# Altium project BB_OPAMP.PrjPcb
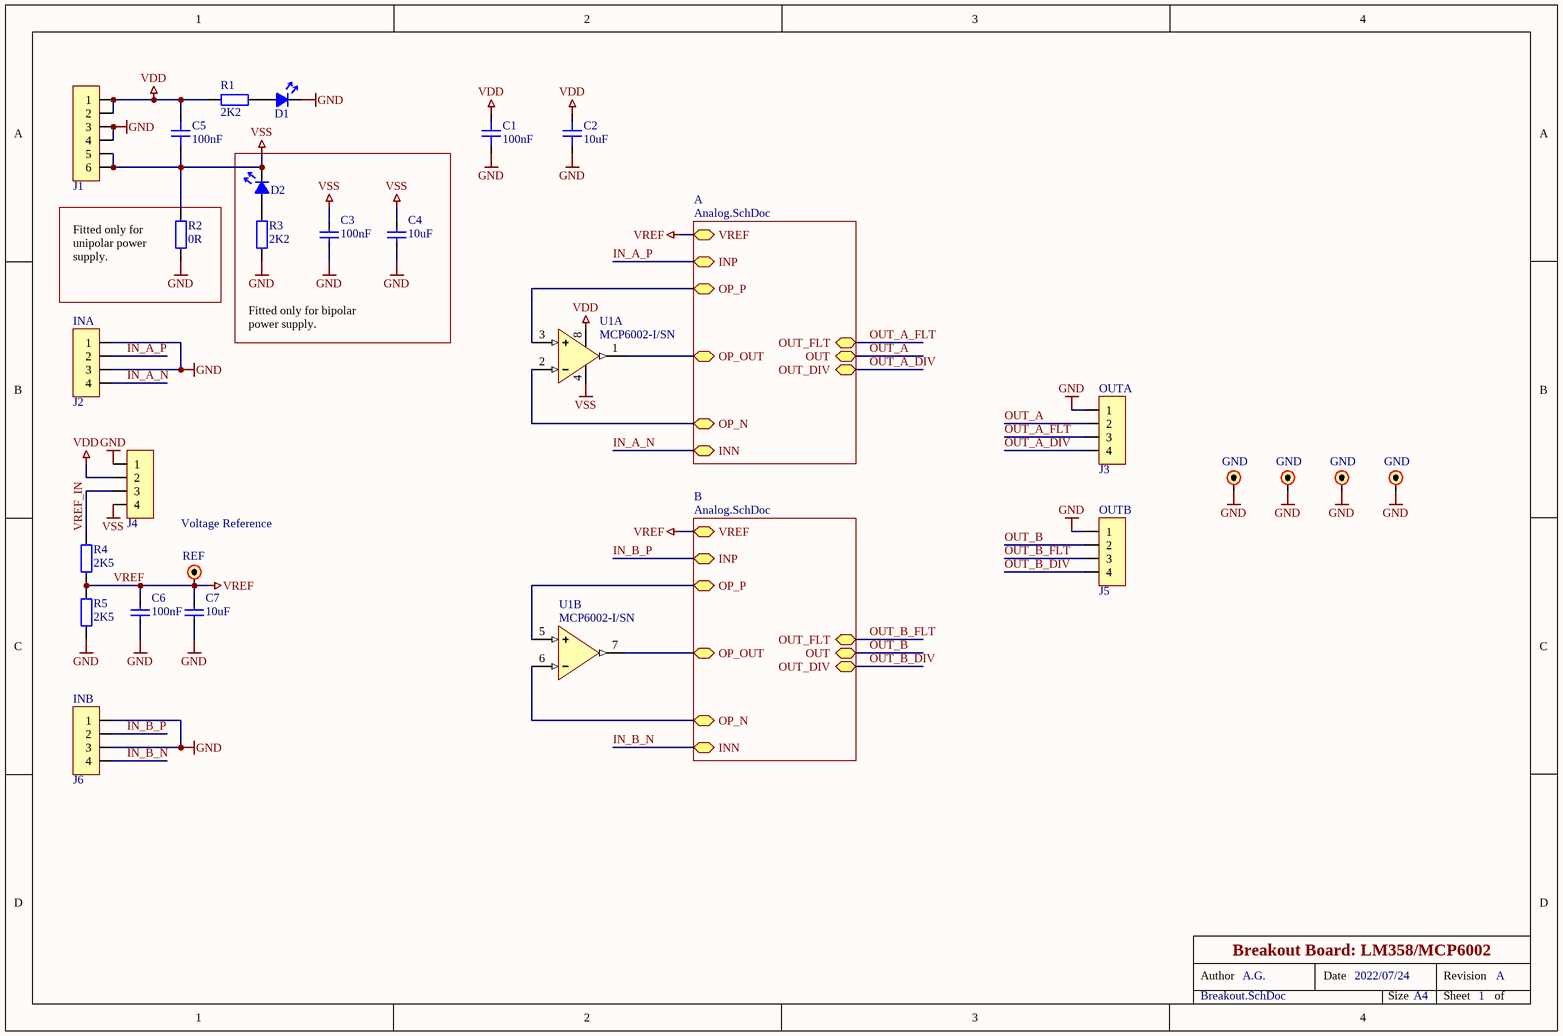
[diagram p0: Breakout.SchDoc]
Title: Breakout Board: LM358/MCP6002; Revision: A; DrawnBy: A.G.; Date: 2022/07/24
2 sheets, 70 parts. Net scope: hierarchical (ports join the sheet entries above them; power ports are global).
Board file: BB_OPAMP.PcbDoc
Sheets:
  Breakout.SchDoc
    A = Analog.SchDoc
    B = Analog.SchDoc

## Sheet Breakout.SchDoc: Breakout Board: LM358/MCP6002
size A4; Date: 2022/07/24; DrawnBy: A.G.; DocumentNumber: 1; Revision: A; SheetNumber: 1; ProjectName: BB_OPAMP.PrjPcb

### Parts
C1  100nF  [0805C_RF_M]
C2  10uF  [0805C_RF_M]
C3  100nF  [0805C_RF_M]
C4  10uF  [0805C_RF_M]
C5  100nF  [0805C_RF_M]
C6  100nF  [0805C_RF_M]
C7  10uF  [0805C_RF_M]
D1  Unspecified  [0805LED_RF_M]  (value not drawn)
D2  Unspecified  [0805LED_RF_M]  (value not drawn)
J1  PINHDR-6P1  [HEADER-2.54-6P1]  (value not drawn)
J2  INA  [HEADER-2.54-4P1]
J3  OUTA  [HEADER-2.54-4P1]
J4  PINHDR-4P1  [HEADER-2.54-4P1]  (value not drawn)
J5  OUTB  [HEADER-2.54-4P1]
J6  INB  [HEADER-2.54-4P1]
R1  2K2  [0805R_RF_M]
R2  0R  [0805R_RF_M]
R3  2K2  [0805R_RF_M]
R4  2K5  [0805R_RF_M]
R5  2K5  [0805R_RF_M]
TP1  GND  [PAD_R_1.5MM]
TP2  GND  [PAD_R_1.5MM]
TP3  GND  [PAD_R_1.5MM]
TP4  GND  [PAD_R_1.5MM]
TP10  REF  [PAD_R_1.5MM]
U1  MCP6002-I/SN  [SOIC-8]  (parts A,B of 2)

### Sub-sheets
A = Analog.SchDoc: OP_OUT, VREF, OUT_FLT, OP_P, OUT, OUT_DIV, INN, INP, OP_N
B = Analog.SchDoc: OP_OUT, VREF, OUT_FLT, OP_P, OUT, OUT_DIV, INN, INP, OP_N

### Nets
GND: C1.1 C2.1 C3.1 C4.1 C6.1 C7.1 D1.C J1.3 J1.4 J2.1 J2.3 J3.1 J4.1 J5.1 J6.1 J6.3 R2.1 R3.2 R5.1 TP1.1 TP2.1 TP3.1 TP4.1
VDD: C1.2 C2.2 C5.2 J1.1 J1.2 J4.2 R1.1 U1.8
VREF: C6.2 C7.2 R4.1 R5.2 TP10.1 ; sheet A/VREF, sheet B/VREF
VSS: C3.2 C4.2 C5.1 D2.C J1.5 J1.6 J4.4 R2.2 U1.4
FBKN: U1.6 ; sheet B/OP_N
FBKN: U1.2 ; sheet A/OP_N  [a separate net that carries the same name]
FBKP: U1.5 ; sheet B/OP_P
FBKP: U1.3 ; sheet A/OP_P  [a separate net that carries the same name]
IN_A_N: J2.4 ; sheet A/INN
IN_A_P: J2.2 ; sheet A/INP
IN_B_N: J6.4 ; sheet B/INN
IN_B_P: J6.2 ; sheet B/INP
OUT_A: J3.2 U1.1 ; sheet A/OP_OUT, sheet A/OUT  [project net OUT]
OUT_A_DIV: J3.4 ; sheet A/OUT_DIV
OUT_A_FLT: J3.3 ; sheet A/OUT_FLT
OUT_B: J5.2 U1.7 ; sheet B/OP_OUT, sheet B/OUT  [project net OUT]
OUT_B_DIV: J5.4 ; sheet B/OUT_DIV
OUT_B_FLT: J5.3 ; sheet B/OUT_FLT
VREF_IN: J4.3 R4.2
NetD1_A: D1.A R1.2
NetD2_A: D2.A R3.1

### Notes on the sheet
- (near R2) Fitted only for unipolar power supply.
- Fitted only for bipolar power supply.
- Voltage Reference
- Author
- Date
- Revision
- Size
- A4
- Sheet
- of

### Library data of the parts
C1-C7 = C: Capacitor; Manufacturer: Generic Brand; Max Voltage: ? V; Tolerance: ?; Mounting Technology: SMT; Tag: *; Manufacturer Part No: *; Supplier: *; Supplier Link: http://; Supplier Part No: *; Category: Capacitor
  C1 C3 C5 C6: Value: 100nF
  C2 C4 C7: Value: 10uF
D1 D2 = LED: Manufacturer: Generic Brand; Forward Voltage Drop: ? V; Emitting Color: Unspecified; Manufacturer Part No: *; Supplier: *; Supplier Link: http://; Supplier Part No: *; Category: Diode; Mounting Technology: SMT
J1 = PINHDR-6P1: Pin Header Single Row 6 Positions; Mounting Technology: THT
J2-J6 = PINHDR-4P1: Generic Pin Header 4x1
R1-R5 = R: Resistor; Manufacturer: Generic Brand; Power Rating: ? W; Max Voltage: ? V; Tolerance: ?; Supplier Link: http://; Category: Resistor; Mounting Technology: SMT
  R1 R3: Value: 2K2
  R2: Value: 0R
  R4 R5: Value: 2K5
TP1-TP4 TP10 = Test Point: Test Point / Pad
U1 = MCP6002-I/SN: IC OPAMP GP 2 CIRCUIT 8SOIC; DIGIKEY_PART_NO: MCP6002-I/SN-ND; DIGIKEY_URL: https://www.digikey.com/en/products/detail/microchip-technology/MCP6002-I-SN/500876; DIGIKEY_UNIT_PRICE: $0.33

## Sheet Analog.SchDoc: Breakout Board: LM358/MCP6002
size A4; Date: 2022/07/24; DrawnBy: A.G.; DocumentNumber: 1; Revision: A; SheetNumber: 1; ProjectName: BB_OPAMP.PrjPcb
Used 2 times, as channels A, B. Parts and nets are listed once, with the designators drawn on the sheet.
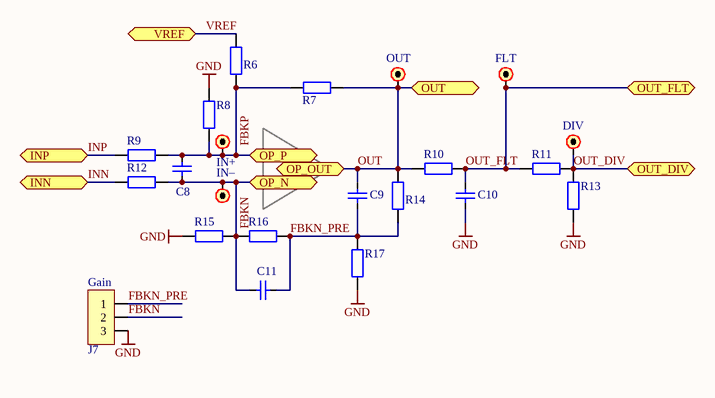
[diagram p1: Analog.SchDoc]

### Parts
C8  ? F  [0805C_RF_M]  (value not drawn)
C9  ? F  [0805C_RF_M]  (value not drawn)
C10  ? F  [0805C_RF_M]  (value not drawn)
C11  ? F  [0805C_RF_M]  (value not drawn)
J7  Gain  [HEADER-2.54-3P1]
R6  ? R  [0805R_RF_M]  (value not drawn)
R7  ? R  [0805R_RF_M]  (value not drawn)
R8  ? R  [0805R_RF_M]  (value not drawn)
R9  ? R  [0805R_RF_M]  (value not drawn)
R10  ? R  [0805R_RF_M]  (value not drawn)
R11  ? R  [0805R_RF_M]  (value not drawn)
R12  ? R  [0805R_RF_M]  (value not drawn)
R13  ? R  [0805R_RF_M]  (value not drawn)
R14  ? R  [0805R_RF_M]  (value not drawn)
R15  ? R  [0805R_RF_M]  (value not drawn)
R16  ? R  [0805R_RF_M]  (value not drawn)
R17  ? R  [0805R_RF_M]  (value not drawn)
TP5  OUT  [PAD_R_1.5MM]
TP6  FLT  [PAD_R_1.5MM]
TP7  DIV  [PAD_R_1.5MM]
TP8  IN+  [PAD_R_1.5MM]
TP9  IN–  [PAD_R_1.5MM]

### Ports
INN, INP, OP_N, OP_OUT, OP_P, OUT, OUT_DIV, OUT_FLT, VREF

### Nets
GND: C10.1 J7.3 R8.2 R13.1 R15.1 R17.1
FBKN: C8.2 C11.2 J7.2 R12.2 R15.2 R16.1 TP9.1 ; port OP_N
FBKN_PRE: C9.1 C11.1 J7.1 R14.1 R16.2 R17.2
FBKP: C8.1 R6.2 R7.2 R8.1 R9.1 TP8.1 ; port OP_P
INN: R12.1 ; port INN
INP: R9.2 ; port INP
OUT: C9.2 R7.1 R10.1 R14.2 TP5.1 ; port OUT, port OP_OUT
OUT_DIV: R11.2 R13.2 TP7.1 ; port OUT_DIV
OUT_FLT: C10.2 R10.2 R11.1 TP6.1 ; port OUT_FLT
VREF: R6.1 ; port VREF

### Channels
A: designators end in #1; ports INN=IN_A_N INP=IN_A_P OP_N=FBKN OP_OUT=OUT OP_P=FBKP OUT=OUT OUT_DIV=OUT_A_DIV OUT_FLT=OUT_A_FLT VREF=VREF
B: designators end in #2; ports INN=IN_B_N INP=IN_B_P OP_N=FBKN OP_OUT=OUT OP_P=FBKP OUT=OUT OUT_DIV=OUT_B_DIV OUT_FLT=OUT_B_FLT VREF=VREF

### Notes on the sheet
- Author
- Date
- Revision
- Size
- A4
- Sheet
- of

### Library data of the parts
C8-C11 = C: as C1 on sheet Breakout; Value: ? F; Tolerance: ?; Mounting Technology: SMT; Tag: *; Manufacturer Part No: *; Supplier: *; Supplier Link: http://; Supplier Part No: *; Category: Capacitor
J7 = PINHDR-3P1: Generic Pin Header 3x1
R6-R17 = R: as R1 on sheet Breakout; Value: ? R; Tolerance: ?; Supplier Link: http://; Category: Resistor; Mounting Technology: SMT
TP5-TP9 = Test Point: Test Point / Pad

## Nets that join several sheets
GND: Breakout (23 pins), A (6 pins), B (6 pins)
VREF: Breakout (5 pins), A (R6#1.1), B (R6#2.1)
FBKN: Breakout (U1.6), B (7 pins)
FBKN: Breakout (U1.2), A (7 pins)
FBKP: Breakout (U1.5), B (6 pins)
FBKP: Breakout (U1.3), A (6 pins)
IN_A_N: Breakout (J2.4), A (R12#1.1)
IN_A_P: Breakout (J2.2), A (R9#1.2)
IN_B_N: Breakout (J6.4), B (R12#2.1)
IN_B_P: Breakout (J6.2), B (R9#2.2)
OUT: Breakout (J3.2 U1.1), A (5 pins)
OUT: Breakout (J5.2 U1.7), B (5 pins)
OUT_A_DIV: Breakout (J3.4), A (R11#1.2 R13#1.2 TP7#1.1)
OUT_A_FLT: Breakout (J3.3), A (C10#1.2 R10#1.2 R11#1.1 TP6#1.1)
OUT_B_DIV: Breakout (J5.4), B (R11#2.2 R13#2.2 TP7#2.1)
OUT_B_FLT: Breakout (J5.3), B (C10#2.2 R10#2.2 R11#2.1 TP6#2.1)